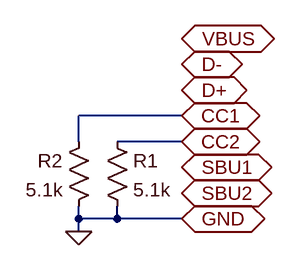
[diagram p0: schematic USBC.asc]
USBC.asc, the LTspice schematic file:
Version 4
SHEET 1 880 680
WIRE 64 208 -64 208
WIRE -64 240 -64 208
WIRE 64 240 -16 240
WIRE -64 336 -64 320
WIRE -16 336 -16 320
WIRE -16 336 -64 336
WIRE 64 336 -16 336
WIRE -64 352 -64 336
FLAG 64 112 VBUS
IOPIN 64 112 BiDir
FLAG 64 144 D-
IOPIN 64 144 BiDir
FLAG 64 176 D+
IOPIN 64 176 BiDir
FLAG 64 208 CC1
IOPIN 64 208 BiDir
FLAG 64 240 CC2
IOPIN 64 240 BiDir
FLAG 64 272 SBU1
IOPIN 64 272 BiDir
FLAG 64 304 SBU2
IOPIN 64 304 BiDir
FLAG 64 336 GND
IOPIN 64 336 BiDir
FLAG -64 352 0
SYMBOL res -32 224 R0
SYMATTR InstName R1
SYMATTR Value 5.1k
SYMBOL res -48 224 M0
SYMATTR InstName R2
SYMATTR Value 5.1k

The netlist it stands for:
* USBC.asc
R1 CC2 0 5.1k
R2 CC1 0 5.1k
.backanno
.end